# EAGLE schematic mainboard (EAGLE 6.3)
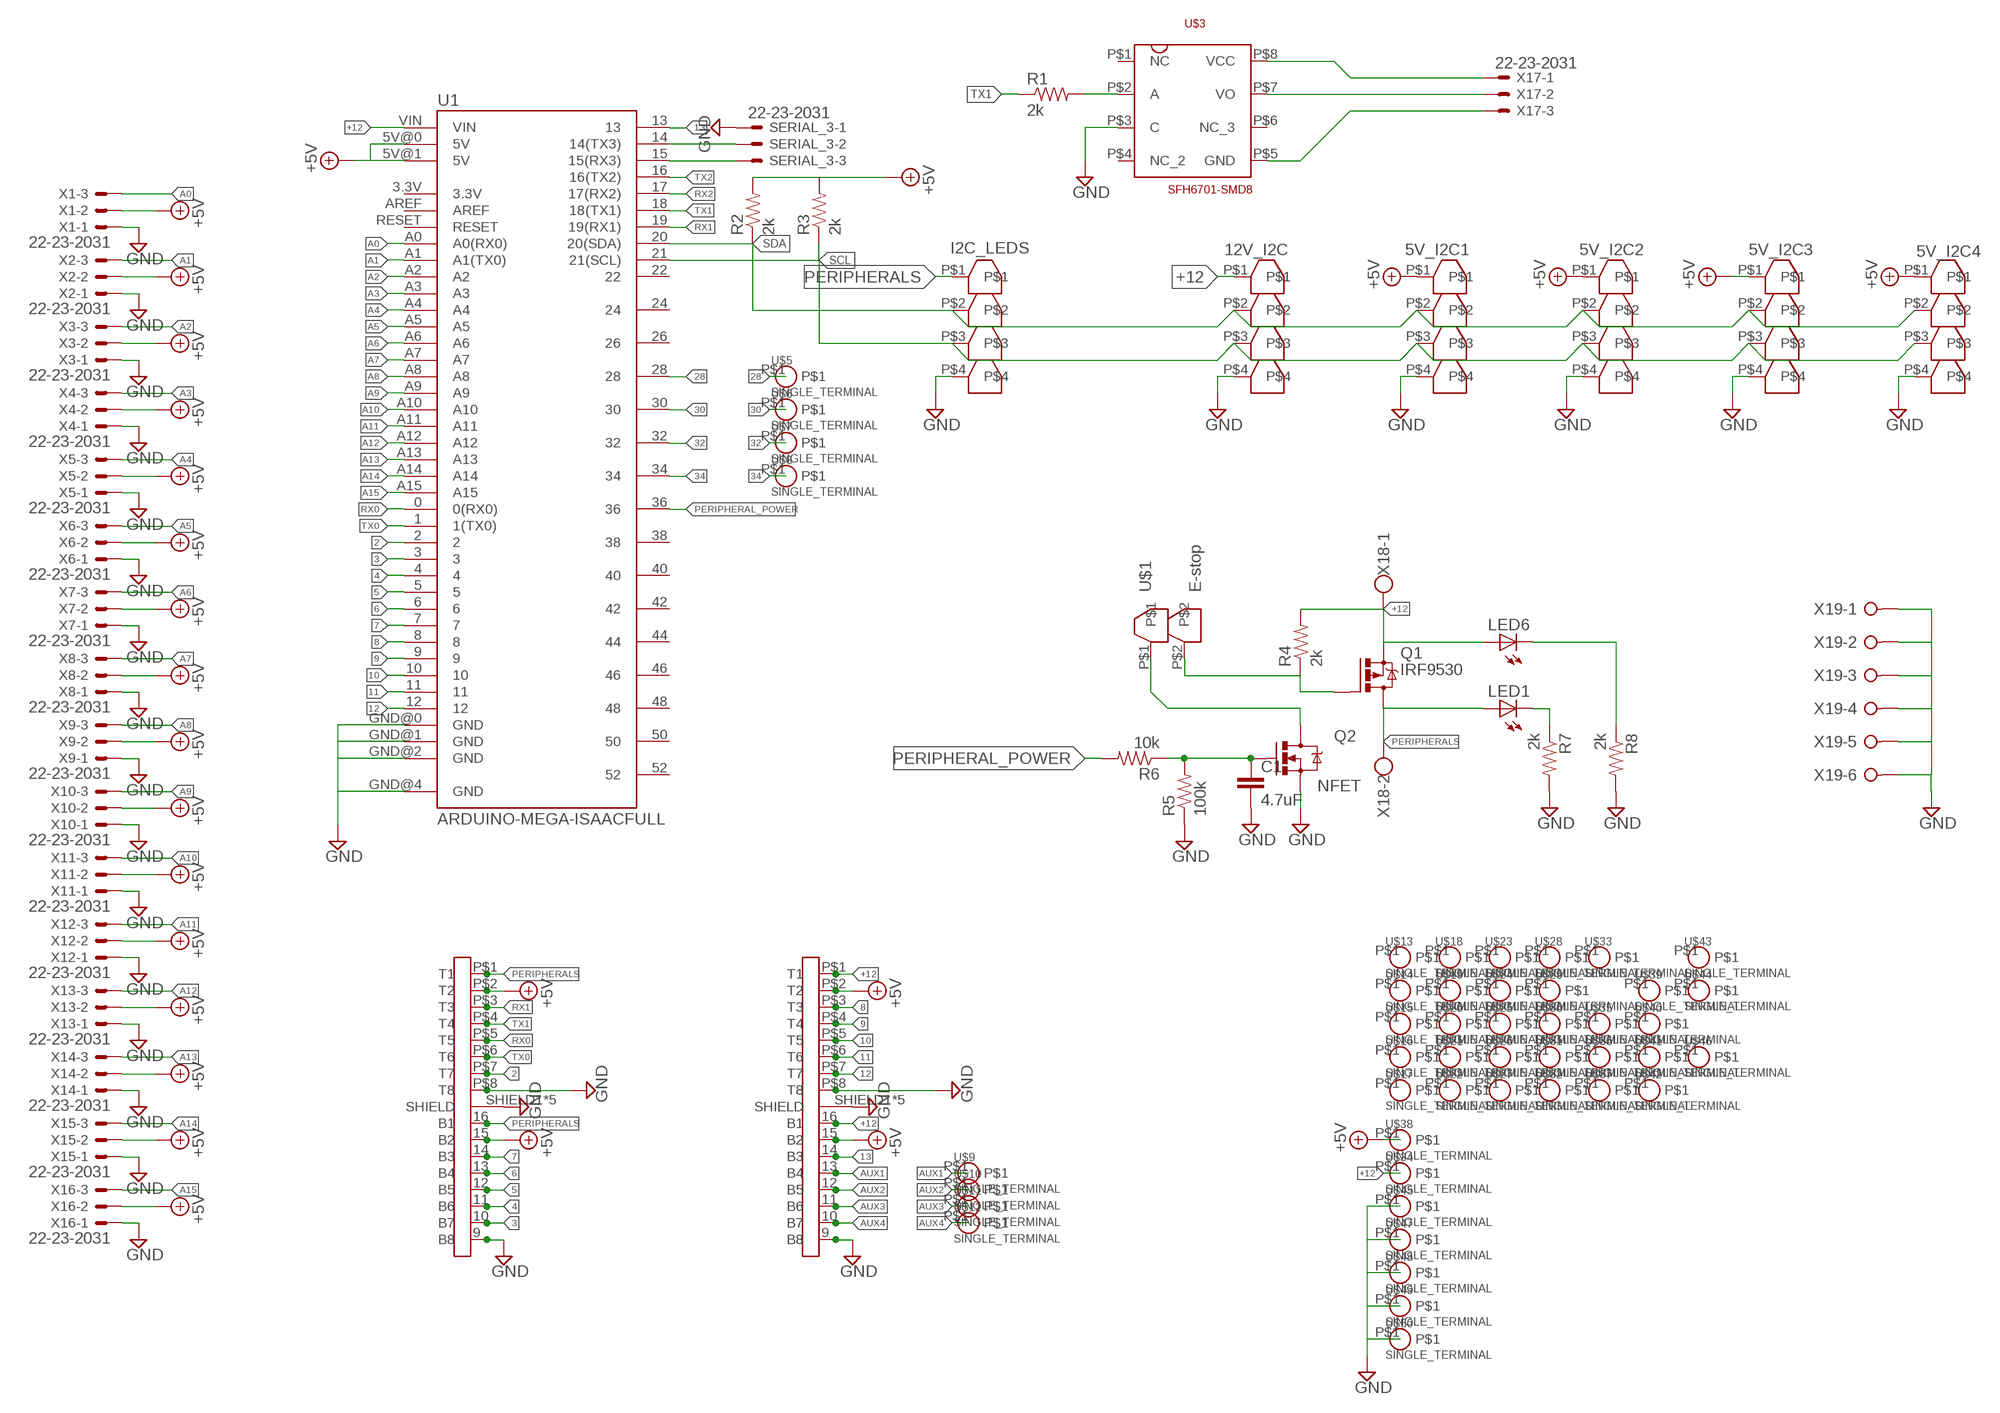
[diagram p0: schematic, sheet 1]

## Parts
5V_I2C1  SCREW_TERMINAL_4  [SCREW_TERMINAL_4]
5V_I2C2  SCREW_TERMINAL_4  [SCREW_TERMINAL_4]
5V_I2C3  SCREW_TERMINAL_4  [SCREW_TERMINAL_4]
5V_I2C4  SCREW_TERMINAL_4  [SCREW_TERMINAL_4]
12V_I2C  SCREW_TERMINAL_4  [SCREW_TERMINAL_4]
C1  4.7uF  C-EUC0603  [C0603]
I2C_LEDS  SCREW_TERMINAL_4  [SCREW_TERMINAL_4]
LED1  LED0603  [LED-0603]
LED6  LED0603  [LED-0603]
Q1  IRF9530  [TO220BV]
Q2  NFET  MOSFET-NCHANNELBSS123LT1G  [SOT23]
R1  2k  RESISTOR0603-RES  [0603-RES]
R2  2k  RESISTOR0603-RES  [0603-RES]
R3  2k  RESISTOR0603-RES  [0603-RES]
R4  2k  RESISTOR0603-RES  [0603-RES]
R5  100k  RESISTOR0603-RES  [0603-RES]
R6  10k  RESISTOR0603-RES  [0603-RES]
R7  2k  RESISTOR0603-RES  [0603-RES]
R8  2k  RESISTOR0603-RES  [0603-RES]
SERIAL_3  22-23-2031  [22-23-2031]
U1  ARDUINO-MEGA-ISAACFULL  [ARDUINO_MEGA_ISAAC]
U$1  E-stop  SCREW_TERMINAL_2  [SCREW_TERMINAL_2]
U$2  RJ45-DUAL-STACKED  [RJ45-DUAL-10118096]
U$3  SFH6701-SMD8  [8-SMD-GULLWING]
U$4  RJ45-DUAL-STACKED  [RJ45-DUAL-10118096]
U$5  SINGLE_TERMINAL  [PLATED_HOLE]
U$6  SINGLE_TERMINAL  [PLATED_HOLE]
U$7  SINGLE_TERMINAL  [PLATED_HOLE]
U$8  SINGLE_TERMINAL  [PLATED_HOLE]
U$9  SINGLE_TERMINAL  [PLATED_HOLE]
U$10  SINGLE_TERMINAL  [PLATED_HOLE]
U$11  SINGLE_TERMINAL  [PLATED_HOLE]
U$12  SINGLE_TERMINAL  [PLATED_HOLE]
U$13  SINGLE_TERMINAL  [PLATED_HOLE]
U$14  SINGLE_TERMINAL  [PLATED_HOLE]
U$15  SINGLE_TERMINAL  [PLATED_HOLE]
U$16  SINGLE_TERMINAL  [PLATED_HOLE]
U$17  SINGLE_TERMINAL  [PLATED_HOLE]
U$18  SINGLE_TERMINAL  [PLATED_HOLE]
U$19  SINGLE_TERMINAL  [PLATED_HOLE]
U$20  SINGLE_TERMINAL  [PLATED_HOLE]
U$21  SINGLE_TERMINAL  [PLATED_HOLE]
U$22  SINGLE_TERMINAL  [PLATED_HOLE]
U$23  SINGLE_TERMINAL  [PLATED_HOLE]
U$24  SINGLE_TERMINAL  [PLATED_HOLE]
U$25  SINGLE_TERMINAL  [PLATED_HOLE]
U$26  SINGLE_TERMINAL  [PLATED_HOLE]
U$27  SINGLE_TERMINAL  [PLATED_HOLE]
U$28  SINGLE_TERMINAL  [PLATED_HOLE]
U$29  SINGLE_TERMINAL  [PLATED_HOLE]
U$30  SINGLE_TERMINAL  [PLATED_HOLE]
U$31  SINGLE_TERMINAL  [PLATED_HOLE]
U$32  SINGLE_TERMINAL  [PLATED_HOLE]
U$33  SINGLE_TERMINAL  [PLATED_HOLE]
U$34  SINGLE_TERMINAL  [PLATED_HOLE]
U$35  SINGLE_TERMINAL  [PLATED_HOLE]
U$36  SINGLE_TERMINAL  [PLATED_HOLE]
U$37  SINGLE_TERMINAL  [PLATED_HOLE]
U$38  SINGLE_TERMINAL  [PLATED_HOLE]
U$39  SINGLE_TERMINAL  [PLATED_HOLE]
U$40  SINGLE_TERMINAL  [PLATED_HOLE]
U$41  SINGLE_TERMINAL  [PLATED_HOLE]
U$42  SINGLE_TERMINAL  [PLATED_HOLE]
U$43  SINGLE_TERMINAL  [PLATED_HOLE]
U$44  SINGLE_TERMINAL  [PLATED_HOLE]
U$45  SINGLE_TERMINAL  [PLATED_HOLE]
U$46  SINGLE_TERMINAL  [PLATED_HOLE]
U$47  SINGLE_TERMINAL  [PLATED_HOLE]
U$48  SINGLE_TERMINAL  [PLATED_HOLE]
U$49  SINGLE_TERMINAL  [PLATED_HOLE]
U$50  SINGLE_TERMINAL  [PLATED_HOLE]
X1  22-23-2031  [22-23-2031]
X2  22-23-2031  [22-23-2031]
X3  22-23-2031  [22-23-2031]
X4  22-23-2031  [22-23-2031]
X5  22-23-2031  [22-23-2031]
X6  22-23-2031  [22-23-2031]
X7  22-23-2031  [22-23-2031]
X8  22-23-2031  [22-23-2031]
X9  22-23-2031  [22-23-2031]
X10  22-23-2031  [22-23-2031]
X11  22-23-2031  [22-23-2031]
X12  22-23-2031  [22-23-2031]
X13  22-23-2031  [22-23-2031]
X14  22-23-2031  [22-23-2031]
X15  22-23-2031  [22-23-2031]
X16  22-23-2031  [22-23-2031]
X17  22-23-2031  [22-23-2031]
X18  W237-102  [W237-102]
X19  W237-06P  [W237-6P]

## Nets
2: U1.2 U$4.P$7(T7)
3: U1.3 U$4.10(B7)
4: U1.4 U$4.11(B6)
5: U1.5 U$4.12(B5)
6: U1.6 U$4.13(B4)
7: U1.7 U$4.14(B3)
8: U1.8 U$2.P$3(T3)
9: U1.9 U$2.P$4(T4)
10: U1.10 U$2.P$5(T5)
11: U1.11 U$2.P$6(T6)
12: U1.12 U$2.P$7(T7)
13: U1.13 U$2.14(B3)
28: U1.28 U$5.P$1
30: U1.30 U$6.P$1
32: U1.32 U$7.P$1
34: U1.34 U$8.P$1
+5V: 5V_I2C1.P$1 5V_I2C2.P$1 5V_I2C3.P$1 5V_I2C4.P$1 R2.2 R3.2 U1.5V@0(5V) U1.5V@1(5V) U$2.15(B2) U$2.P$2(T2) U$4.15(B2) U$4.P$2(T2) U$38.P$1 X1.2 X2.2 X3.2 X4.2 X5.2 X6.2 X7.2 X8.2 X9.2 X10.2 X11.2 X12.2 X13.2 X14.2 X15.2 X16.2
+12: 12V_I2C.P$1 LED6.A Q1.S R4.2 U1.VIN U$2.16(B1) U$2.P$1(T1) U$34.P$1 X18.1
A0: U1.A0(A0(RX0)) X1.3
A1: U1.A1(A1(TX0)) X2.3
A2: U1.A2 X3.3
A3: U1.A3 X4.3
A4: U1.A4 X5.3
A5: U1.A5 X6.3
A6: U1.A6 X7.3
A7: U1.A7 X8.3
A8: U1.A8 X9.3
A9: U1.A9 X10.3
A10: U1.A10 X11.3
A11: U1.A11 X12.3
A12: U1.A12 X13.3
A13: U1.A13 X14.3
A14: U1.A14 X15.3
A15: U1.A15 X16.3
AUX1: U$2.13(B4) U$9.P$1
AUX2: U$2.12(B5) U$10.P$1
AUX3: U$2.11(B6) U$11.P$1
AUX4: U$2.10(B7) U$12.P$1
GND: 5V_I2C1.P$4 5V_I2C2.P$4 5V_I2C3.P$4 5V_I2C4.P$4 12V_I2C.P$4 C1.2 I2C_LEDS.P$4 Q2.2(S) R5.1 R7.2 R8.2 SERIAL_3.1 U1.GND@0(GND) U1.GND@1(GND) U1.GND@2(GND) U1.GND@4(GND) U$2.9(B8) U$2.P$8(T8) U$2.SHIELD1(SHIELD) U$2.SHIELD2(SHIELD) U$2.SHIELD3(SHIELD) U$2.SHIELD4(SHIELD) U$2.SHIELD5(SHIELD) U$3.P$3(C) U$4.9(B8) U$4.P$8(T8) U$4.SHIELD1(SHIELD) U$4.SHIELD2(SHIELD) U$4.SHIELD3(SHIELD) U$4.SHIELD4(SHIELD) U$4.SHIELD5(SHIELD) U$45.P$1 U$47.P$1 U$48.P$1 U$49.P$1 U$50.P$1 X1.1 X2.1 X3.1 X4.1 X5.1 X6.1 X7.1 X8.1 X9.1 X10.1 X11.1 X12.1 X13.1 X14.1 X15.1 X16.1 X19.1 X19.2 X19.3 X19.4 X19.5 X19.6
N: Q1.G R4.1 U$1.P$2
N1: C1.1 Q2.1(G) R5.2 R6.1
N$1: U$3.P$8(VCC) X17.1
N$2: R1.2 U$3.P$2(A)
N$3: U$3.P$7(VO) X17.2
N$4: U$3.P$5(GND) X17.3
N$5: SERIAL_3.3 U1.15(15(RX3))
N$6: SERIAL_3.2 U1.14(14(TX3))
N$7: Q2.3(D) U$1.P$1
N$8: LED1.C R7.1
N$9: LED6.C R8.1
PERIPHERAL_POWER: R6.2 U1.36
PERIPHERALS: I2C_LEDS.P$1 LED1.A Q1.D U$4.16(B1) U$4.P$1(T1) X18.2
RX0: U1.0(0(RX0)) U$4.P$5(T5)
RX1: U1.19(19(RX1)) U$4.P$3(T3)
RX2: U1.17(17(RX2))
SCL: 5V_I2C1.P$3 5V_I2C2.P$3 5V_I2C3.P$3 5V_I2C4.P$3 12V_I2C.P$3 I2C_LEDS.P$3 R3.1 U1.21(21(SCL))
SDA: 5V_I2C1.P$2 5V_I2C2.P$2 5V_I2C3.P$2 5V_I2C4.P$2 12V_I2C.P$2 I2C_LEDS.P$2 R2.1 U1.20(20(SDA))
TX0: U1.1(1(TX0)) U$4.P$6(T6)
TX1: R1.1 U1.18(18(TX1)) U$4.P$4(T4)
TX2: U1.16(16(TX2))
Unconnected: U1.3.3V U1.22 U1.24 U1.26 U1.38 U1.40 U1.42 U1.44 U1.46 U1.48 U1.50 U1.52 U1.AREF U1.RESET U$3.P$1(NC) U$3.P$4(NC_2) U$3.P$6(NC_3) U$13.P$1 U$14.P$1 U$15.P$1 U$16.P$1 U$17.P$1 U$18.P$1 U$19.P$1 U$20.P$1 U$21.P$1 U$22.P$1 U$23.P$1 U$24.P$1 U$25.P$1 U$26.P$1 U$27.P$1 U$28.P$1 U$29.P$1 U$30.P$1 U$31.P$1 U$32.P$1 U$33.P$1 U$35.P$1 U$36.P$1 U$37.P$1 U$39.P$1 U$40.P$1 U$41.P$1 U$42.P$1 U$43.P$1 U$44.P$1 U$46.P$1

## Library data of the parts
5V_I2C1-5V_I2C4 12V_I2C I2C_LEDS = isaac1:SCREW_TERMINAL_4
C1 = rcl:C-EU: CAPACITOR, European symbol
LED1 LED6 = SparkFun-LED:LED: LEDs Standard schematic elements and footprints for 5mm, 3mm, 1206, and 0603 sized LEDs. 5mm - Spark Fun Electronics SKU : COM-00529 (and others)
Q1 = Adams Chips:IRF9530: P-CHANNEL HEXFET POWER-MOS-FET Source: http://www.irf.com/product-info/datasheets/data/irf9530.pdf
Q2 = SparkFun-DiscreteSemi:MOSFET-NCHANNEL: Common NMOSFET Parts MFG P/N Store ID Prod ID FDD8780 TRANS-09984 SI7820DN TRANS-11055 FDS6630A IC-08089 2N7002PW TRANS-11151 FQP30N06L COM-10213 TRANS-10060 BSS123LT1G TRANS-08345 BSS138 TRANS-00830 BS170 2N7000; PROD_ID: TRANS-08345
R1-R8 = SparkFun-Resistors:RESISTOR: Resistor Basic schematic elements and footprints for 0603, 1206, and PTH resistors.
SERIAL_3 X1-X17 = con-molex:22-23-2031: .100" (2.54mm) Center Header - 3 Pin; MF: MOLEX; MPN: 22-23-2031; OC_FARNELL: 1462950; OC_NEWARK: 30C0862
U1 = SparkFun-Boards - Isaac_Copy:ARDUINO-MEGA-ISAAC: Arduino Mega board footprint
U$1 = isaac1:SCREW_TERMINAL_2
U$2 U$4 = isaac1:RJ45-DUAL-STACKED
U$3 = isaac1:SFH6701-SMD8
U$5-U$50 = isaac1:SINGLE_TERMINAL
X18 = con-wago-500:W237-102: WAGO SCREW CLAMP; MPN: 237-102; OC_FARNELL: unknown; OC_NEWARK: 70K9898
X19 = con-wago-508:W237-06P: WAGO SREW CLAMP; OC_FARNELL: unknown; OC_NEWARK: unknown